# Altium project DriverBoard.PrjPcb
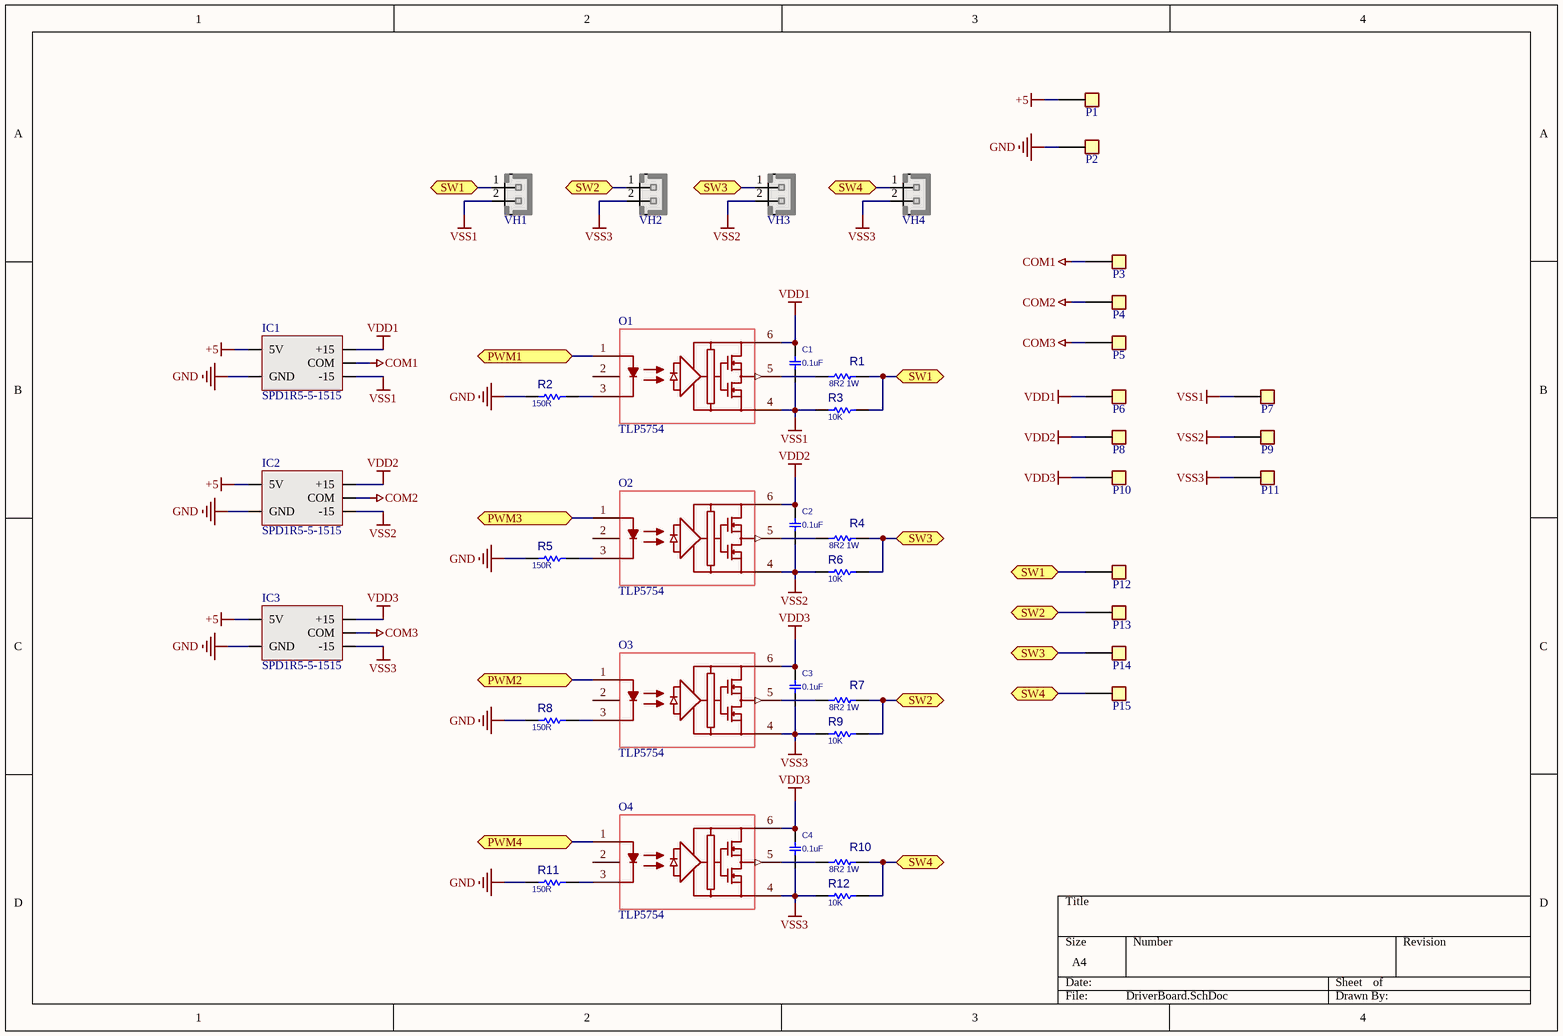
[diagram p0: DriverBoard.SchDoc]
1 sheet, 42 parts. Net scope: flat (ports and power ports of the same name join across sheets).
Board file: DriverBoard.PcbDoc

## Sheet DriverBoard.SchDoc
size A4; SheetNumber: 1; SheetTotal: 1

### Parts
C1  0.1uF  [cap_0805]
C2  0.1uF  [cap_0805]
C3  0.1uF  [cap_0805]
C4  0.1uF  [cap_0805]
IC1  SPD1R5-5-1515  [SPS1R5]
IC2  SPD1R5-5-1515  [SPS1R5]
IC3  SPD1R5-5-1515  [SPS1R5]
O1  TLP5754  [TLP5754]
O2  TLP5754  [TLP5754]
O3  TLP5754  [TLP5754]
O4  TLP5754  [TLP5754]
P1  test PCB  [tp_red_1p]  (value not drawn)
P2  test PCB  [Tp_black_1p]  (value not drawn)
P3  test PCB  [tp_white_1p]  (value not drawn)
P4  test PCB  [tp_white_1p]  (value not drawn)
P5  test PCB  [tp_white_1p]  (value not drawn)
P6  test PCB  [tp_red_1p]  (value not drawn)
P7  test PCB  [Tp_black_1p]  (value not drawn)
P8  test PCB  [tp_red_1p]  (value not drawn)
P9  test PCB  [Tp_black_1p]  (value not drawn)
P10  test PCB  [tp_red_1p]  (value not drawn)
P11  test PCB  [Tp_black_1p]  (value not drawn)
P12  test PCB  [Tp_blue_1p]  (value not drawn)
P13  test PCB  [Tp_blue_1p]  (value not drawn)
P14  test PCB  [Tp_blue_1p]  (value not drawn)
P15  test PCB  [Tp_blue_1p]  (value not drawn)
R1  8R2 1W  [R2512]
R2  150R  [R0805]
R3  10K  [R0805]
R4  8R2 1W  [R2512]
R5  150R  [R0805]
R6  10K  [R0805]
R7  8R2 1W  [R2512]
R8  150R  [R0805]
R9  10K  [R0805]
R10  8R2 1W  [R2512]
R11  150R  [R0805]
R12  10K  [R0805]
VH1  HHDR_2  [VH-2]  (value not drawn)
VH2  HHDR_2  [VH-2]  (value not drawn)
VH3  HHDR_2  [VH-2]  (value not drawn)
VH4  HHDR_2  [VH-2]  (value not drawn)

### Ports
PWM1 (bidir), PWM2 (bidir), PWM3 (bidir), PWM4 (bidir), SW1 (bidir), SW2 (bidir), SW3 (bidir), SW4 (bidir)

### Nets
+5: IC1.1(5V) IC2.1(5V) IC3.1(5V) P1.1
COM1: IC1.4(COM) P3.1
COM2: IC2.4(COM) P4.1
COM3: IC3.4(COM) P5.1
GND: IC1.2(GND) IC2.2(GND) IC3.2(GND) P2.1 R2.1 R5.1 R8.1 R11.1
VDD1: C1.2 IC1.5(+15) O1.6(VCC) P6.1
VDD2: C2.2 IC2.5(+15) O2.6(VCC) P8.1
VDD3: C3.2 C4.2 IC3.5(+15) O3.6(VCC) O4.6(VCC) P10.1
VSS1: C1.1 IC1.3(-15) O1.4(GND) P7.1 R3.1 VH1.2
VSS2: C2.1 IC2.3(-15) O2.4(GND) P9.1 R6.1 VH3.2
VSS3: C3.1 C4.1 IC3.3(-15) O3.4(GND) O4.4(GND) P11.1 R9.1 R12.1 VH2.2 VH4.2
NetO1_1: O1.1(NC) ; port PWM1
NetO1_3: O1.3(KATHODE) R2.2
NetO1_5: O1.5(VO) R1.1
NetO2_1: O2.1(NC) ; port PWM3
NetO2_3: O2.3(KATHODE) R5.2
NetO2_5: O2.5(VO) R4.1
NetO3_1: O3.1(NC) ; port PWM2
NetO3_3: O3.3(KATHODE) R8.2
NetO3_5: O3.5(VO) R7.1
NetO4_1: O4.1(NC) ; port PWM4
NetO4_3: O4.3(KATHODE) R11.2
NetO4_5: O4.5(VO) R10.1
NetP12_1: P12.1 R1.2 R3.2 VH1.1 ; port SW1
NetP13_1: P13.1 R7.2 R9.2 VH2.1 ; port SW2
NetP14_1: P14.1 R4.2 R6.2 VH3.1 ; port SW3
NetP15_1: P15.1 R10.2 R12.2 VH4.1 ; port SW4

Not connected (* = marked no-connect by the designer): O1 2(ANODE); O2 2(ANODE); O3 2(ANODE); O4 2(ANODE)

### Library data of the parts
C1-C4 = CAP SMD: PARAM: -, -%; MANF_P#: MANF_PART#; PARAM2: -V; PRICE: 100= 1$; MANF: -; ASSEMBLY: ASSEMBLY; VALUE: 0.1uF
IC1-IC3 = SPD1R5-5-1515: Power supply Driver SPD1R5-5-1515 / Efficiency 80% / Input 0.381A / Output 50mA
O1-O4 = TLP5754: MF: Toshiba Semiconductor; MP: TLP250; Purchase-URL: https://pricing.snapeda.com/search/part/TLP250/?ref=eda; SnapEDA_Link: https://www.snapeda.com/parts/TLP250/Toshiba+Semiconductor+and+Storage/view-part/?ref=snap; Value: *; Package: DIP-8 Toshiba; Availability: In Stock; Price: None; Check_prices: https://www.snapeda.com/parts/TLP250/Toshiba+Semiconductor+and+Storage/view-part/?ref=eda
P1-P15 = test PCB: testpin
R1-R12 = RES SMD: MANF_P#: WSLP0805R0100FEA; MANF: VISHAY; PARAM: 0.5W, -55~155oC; DESC: DESCRIPTION; DIST#: MOUSER; PARAM2: 1%; ASSEMBLY: ASSEMBLY; PRICE: 0.5$
  R1 R4 R7 R10: VALUE: 8R2 1W
  R2 R5 R8 R11: VALUE: 150R
  R3 R6 R9 R12: VALUE: 10K
VH1-VH4 = VH-2: VALUE: HHDR_2